# Altium schematic sheet 02-Power.SchDoc: ECE315 Analog
size A; Date: 4/25/2017; ApprovedBy: JSK; CheckedBy: JSK; Author: JSK; CompanyName: University of Wisconsin; DrawnBy: JSK; Engineer: JSK; Organization: ECE 315; Address1: College of Engineering; Address2: 1415 Engineering Drive; Address3: Madison, WI 53706; Address4: ECE 315 Fall 2017; Revision: A; SheetNumber: 2; SheetTotal: 2; AssemblyNumber: ECE315-F19; ApprovedDate: 04/02/2019
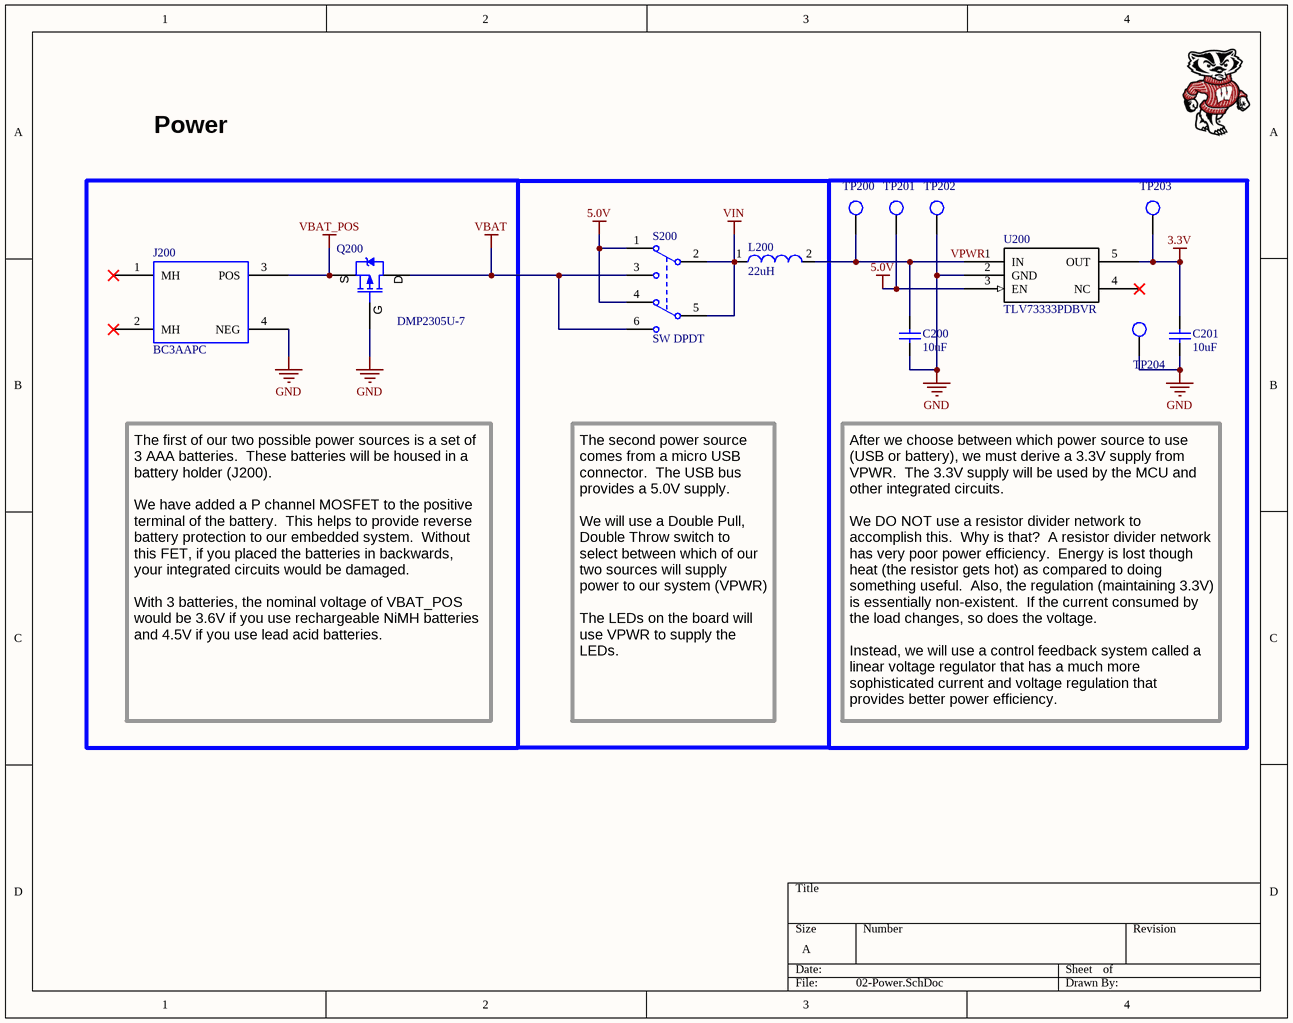
[diagram p0: 02-Power.SchDoc]

## Parts
C200  10uF  [CAP_0805]
C201  10uF  [CAP_0805]
J200  BC3AAPC  [BC3AAPC]
L200  Inductance: 22uH  [SRN3015]  (hidden comment: SRN3015-220M)
Q200  Manufacturer Part Number: DMP2305U-7  [SOT23]  (hidden comment: PMOS-DMP2305U-7)
S200  SW DPDT  [DPDT]
TP200  TP_1206  [TP-SMC-1206]  (value not drawn)
TP201  TP_1206  [TP-SMC-1206]  (value not drawn)
TP202  TP_1206  [TP-SMC-1206]  (value not drawn)
TP203  TP_1206  [TP-SMC-1206]  (value not drawn)
TP204  TP_1206  [TP-SMC-1206]  (value not drawn)
U200  Manufacturer Part Number: TLV73333PDBVR  [IC_TLV73333]  (hidden comment: IC-TLV733P)

## Nets
3.3V: C201.2 TP203.1 U200.5(OUT)
5.0V: S200.1(NC1) S200.4(NC2) TP201.1 U200.3(EN)
GND: C200.1 C201.1 J200.4(NEG) Q200.1(G) TP202.1 TP204.1 U200.2(GND)
VBAT: Q200.3(D) S200.3(NO1) S200.6(NO2)
VBAT_POS: J200.3(POS) Q200.2(S)
VIN: L200.1 S200.2(COMMON1) S200.5(COMMON2)
VPWR: C200.2 L200.2 TP200.1 U200.1(IN)

Not connected (* = marked no-connect by the designer): J200 1(MH)* 2(MH)*; U200 4(NC)*

## Notes on the sheet
- Power
- The first of our two possible power sources is a set of 3 AAA batteries.  These batteries will be housed in a battery holder (J200).
  We have added a P channel MOSFET to the positive terminal of the battery.  This helps to provide reverse battery protection to our embedded system.  Without this FET, if you placed the batteries in backwards, your integrated circuits would be damaged.
  With 3 batteries, the nominal voltage of VBAT_POS would be 3.6V if you use rechargeable NiMH batteries and 4.5V if you use lead acid batteries.
- The second power source comes from a micro USB connector.  The USB bus provides a 5.0V supply.
  We will use a Double Pull, Double Throw switch to select between which of our two sources will supply power to our system (VPWR)
  The LEDs on the board will use VPWR to supply the LEDs.
- After we choose between which power source to use (USB or battery), we must derive a 3.3V supply from VPWR.  The 3.3V supply will be used by the MCU and other integrated circuits.
  We DO NOT use a resistor divider network to accomplish this.  Why is that?  A resistor divider network has very poor power efficiency.  Energy is lost though heat (the resistor gets hot) as compared to doing something useful.  Also, the regulation (maintaining 3.3V) is essentially non-existent.  If the current consumed by the load changes, so does the voltage.
  Instead, we will use a control feedback system called a linear voltage regulator that has a much more sophisticated current and voltage regulation that provides better power efficiency.

## Library data of the parts
C200 C201 = CAP_0805_U_010.00: CAP CER 10UF 16V X7R 0805; Manufacturer: Samsung; Manufacturer Part Number: CL21A106KPCLQNC; Tolerance: 10%; Voltage Rating: 10V; Dielectric: X5R; ComponentLink3URL: https://datasheet.ciiva.com/26920/getdatasheetpartid-355170-26920201.pdf; ComponentLink3Description: https://datasheet.ciiva.com/26920/getdatasheetpartid-355170-26920201.pdf; Supplier 1: Digi-Key; Stock 1: 40000; Pricing 1: 1=0.22, 10=0.148, 100=0.0749, 500=0.05122, 1000=0.04531 (USD); Mount: Surface Mount; Case/Package: 0805; Case Code (Metric): 2012; Case Code (Imperial): 0805; Contact Plating: Tin; Min Operating Temperature: -55°C; Max Operating Temperature: 85°C; Packaging: Tape and Reel; Package Quantity: 1; Length: 2mm; Height: 0.85mm; Width: 0.049inch; Thickness: 0.037inch; Depth: 1.25mm; Radiation Hardening: No; ComponentLink1URL: https://datasheet.ciiva.com/25730/cl21a106kpclqnc-25730594.pdf; ComponentLink1Description: https://datasheet.ciiva.com/25730/cl21a106kpclqnc-25730594.pdf; Supplier Part Number 1: 1276-2402-1-ND; Capacitance: 10uF
J200 = BC3AAPC: BATTERY HOLDER AA 3 CELL PC PIN; Manufacturer: Memory Protection Devices; Number of Cells: 3; Package Quantity: 100; Termination: PC Pin; Min Operating Temperature: -10°C; Supplier: Digi-Key; Max Operating Temperature: 100°C; Mount: Through Hole,PCB; ComponentLink1URL: http://www.memoryprotectiondevices.com/datasheets/BC3AAPC-datasheet.pdf?src-supplier=Digi-Key; ComponentLink1Description: http://www.memoryprotectiondevices.com/datasheets/BC3AAPC-datasheet.pdf?src-supplier=Digi-Key; Supplier Part Number: BC3AAPC-ND; Manufacturer Part Number: BC3AAPC
L200 = SRN3015-220M: 22uH 3x3mm sheilded inductor 600mA; Manufacturer 1: Bourns; Core Material: Ferrite; Saturation Current: 580mA; Tolerance: 20%; Shielding: Shielded; Self Resonant Frequency: 28MHz; DC Resistance (DCR): 622mR; Test Frequency: 1MHz; Supplier 1: Digi-Key; Stock 1: 46536; Pricing 1: 1=0.46000, 10=0.40300, 100=0.28750, 500=0.24150, 1000=0.19550 (USD); RoHS: Yes; Case/Package: 1212; Number of Pins: 2; Weight: 0.001235oz; Contact Plating: Tin; Min Operating Temperature: -40°C; Max Operating Temperature: 125°C; Package Quantity: 2000; Inductance Tolerance: 20%; Packaging: Tape and Reel; Current Rating: 600mA; Composition: Wirewound; Max DC Current: 600mA; Termination: SMD/SMT; DC Current: 600mA; Military Standard: Not; RMS Current (Irms): 600mA; Length: 3.1mm; Height: 1.5mm; Width: 0.118inch; Height - Seated (Max): 0.059inch; Depth: 3.1mm; REACH SVHC: No SVHC; ComponentLink1URL: https://datasheet.ciiva.com/11802/0900766b80fe1f40-11802602.pdf?src-supplier=RSComponents; ComponentLink1Description: https://datasheet.ciiva.com/11802/0900766b80fe1f40-11802602.pdf?src-supplier=RSComponents; ComponentLink2URL: https://datasheet.ciiva.com/1048/srn3015-1048848.pdf?src-supplier=Digi-Key; ComponentLink2Description: https://datasheet.ciiva.com/1048/srn3015-1048848.pdf?src-supplier=Digi-Key; ComponentLink3URL: https://datasheet.ciiva.com/1048/srn3015-1048849.pdf?src-supplier=Digi-Key; ComponentLink3Description: https://datasheet.ciiva.com/1048/srn3015-1048849.pdf?src-supplier=Digi-Key; ComponentLink4URL: https://datasheet.ciiva.com/1048/srn3015-1048850.pdf?src-supplier=Digi-Key; ComponentLink4Description: https://datasheet.ciiva.com/1048/srn3015-1048850.pdf?src-supplier=Digi-Key; ComponentLink5URL: https://datasheet.ciiva.com/30089/587srn3015-30089590.pdf?src-supplier=Onlinecomponents.com; ComponentLink5Description: https://datasheet.ciiva.com/30089/587srn3015-30089590.pdf?src-supplier=Onlinecomponents.com; ComponentLink6URL: https://datasheet.ciiva.com/7849/1481208-7849511.pdf?src-supplier=Element14; ComponentLink6Description: https://datasheet.ciiva.com/7849/1481208-7849511.pdf?src-supplier=Element14; ComponentLink7URL: https://datasheet.ciiva.com/22678/1875284-22678991.pdf?src-supplier=Element14; ComponentLink7Description: https://datasheet.ciiva.com/22678/1875284-22678991.pdf?src-supplier=Element14; Manufacturer Part Number 1: SRN3015-220M; Supplier Part Number 1: SRN3015-220MCT-ND
Q200 = PMOS-DMP2305U-7: MOSFET P-CH 20V 4.2A SOT-23; Manufacturer: Diodes Zetex; Turn-Off Delay Time: 53.8ns; Drain to Source Breakdown Voltage: -20V; Number of Channels: 1; On-State Resistance: 60mR; Power Dissipation: 1.4W; Input Capacitance: 727pF; Turn-On Delay Time: 14ns; Rise Time: 13ns; Gate to Source Voltage (Vgs): 8V; Element Configuration: Single; Threshold Voltage: -500mV; ComponentLink1Description: Manufacturer Link; ComponentLink1URL: http://www.irf.com/; ComponentLink2URL: http://www.diodes.com/_files/datasheets/ds30149.pdf?src-supplier=Future+Electronics; ComponentLink2Description: http://www.diodes.com/_files/datasheets/ds30149.pdf?src-supplier=Future+Electronics; ComponentLink3URL: http://www.diodes.com/datasheets/ds31737.pdf?src-supplier=Avnet+Asia; ComponentLink3Description: http://www.diodes.com/datasheets/ds31737.pdf?src-supplier=Avnet+Asia; Contact Plating: Tin,Matte; Weight: 0.000282oz; Continuous Drain Current (ID): 4.2A; Min Operating Temperature: -55°C; Number of Elements: 1; Mount: Surface Mount; Number of Pins: 3; REACH SVHC: No SVHC; Radiation Hardening: No; Length: 2.9mm; Drain to Source Voltage (Vdss): 20V; Case/Package: SOT-23; Rds On Max: 60mR; Lead Free: Lead Free; Packaging: Tape and Reel; Fall Time: 13ns; Max Power Dissipation: 1.4W; Drain to Source Resistance: 60mR; Max Operating Temperature: 150°C; Width: 1.3mm; Package Quantity: 3000; Supplier: Digi-Key; Height: 1mm; Supplier Part Number: DMP2305UDICT-ND
S200 = SW DPDT: Switch; Manufacturer: ITT /  C&K Components; Manufacturer Part Number: JS202011SCQN; Actuator Color: Black; Maximum DC Voltage Rating: 6 V; Actuator Material: Nylon 4/6; Electrical Life: 15000 Cycles; Body Orientation: Straight; Maximum Contact Resistance: 70 mOhm; Actuator Style: Top Slide; Dielectric Strength: 500 VAC; Minimum Insulation Resistance: 100 MOhm; Contact Rating @ Voltage: 0.3@6VDC A; COO: US; Published: 24-Mar-1999; LatestRevisionDate: 29-May-2009; LatestRevisionNote: IPC-7351 Footprint Added.; PackageVersion: Mar-2001; PackageReference: SOT23-6; Publisher: Altium Limited; PackageDescription: 6-Pin SOT-23 Package 0.95 mm Pitch, 2.7 mm Lead Span; Code_JEITA: SC-74; Code_IPC: SOT26A-6; Supplier 1: C&K Components; Stock 1: 22661; Pricing 1: 1=0.46, 10=0.441, 25=0.4316, 50=0.3858, 100=0.3674, 250=0.3582, 500=0.3031 (USD); Part No: JS202011SCQN; RoHS: Yes; Supplier Standard Pack: 5,000; Type: Sub-Miniature; Maximum AC Voltage Rating: N/A; Family: JS; Contact Material: Copper Alloy; Seal Description: N/A; Pole Throw Configuration: DPDT; Mechanical Life: N/A; Packaging: Tape and Reel; Contact Plating: Silver; Switch Configuration: N/A; Housing Material: Nylon 4/6; Product Weight: N/A; Base Material: N/A; Mounting: Surface Mount,Gull Wing; Seal Location: N/A; Operating Temperature: -40 to 85 C; Dimension: 9 x 7.5 x 5.5 mm; HTS: 8536509050; ECCN: EAR99; ComponentLink1URL: https://datasheet.ciiva.com/23829/1707718-23829488.pdf; ComponentLink1Description: https://datasheet.ciiva.com/23829/1707718-23829488.pdf; ComponentLink2URL: https://datasheet.ciiva.com/2889/js-29aug13-2889127.pdf; ComponentLink2Description: https://datasheet.ciiva.com/2889/js-29aug13-2889127.pdf; ComponentLink3URL: https://datasheet.ciiva.com/2889/js-15sept15-2889128.pdf; ComponentLink3Description: https://datasheet.ciiva.com/2889/js-15sept15-2889128.pdf; ComponentLink4URL: https://datasheet.ciiva.com/2889/js-15sept15-2889129.pdf; ComponentLink4Description: https://datasheet.ciiva.com/2889/js-15sept15-2889129.pdf; ComponentLink5URL: https://datasheet.ciiva.com/22630/1707718-22630697.pdf; ComponentLink5Description: https://datasheet.ciiva.com/22630/1707718-22630697.pdf; ComponentLink6URL: https://datasheet.ciiva.com/8625/js-9dec14-8625470.pdf; ComponentLink6Description: https://datasheet.ciiva.com/8625/js-9dec14-8625470.pdf; Supplier Part Number 1: 401-2002-1-ND
TP200-TP204 = TP_1206: Test Point SMD 1206; Manufacturer: TE Connectivity (Tyco Electronics); Manufacturer Part Number: 1625854-1; Resistance Value: 0 Ohm; Temperature Coefficient: N/R; Supplier 1: Digi-Key; Stock 1: 31937; Pricing 1: 1=0.28, 10=0.261, 25=0.224, 50=0.1902, 100=0.1828, 250=0.1641, 500=0.1567, 1000=0.1306 (USD); Case Size: 1206; Dimension: 3.2 x 1.6 x 1.25mm; Family: RC; Mounting: Surface Mount; Operating Temperature: -55 to 125 C; Part No: 1625854-1; RoHS: Yes; Packaging: Tape and Reel; Termination Style: N/R; Terminal Pitch: N/R; Power Rating: N/R; Tolerance: N/R; ComponentLink1URL: https://datasheet.ciiva.com/6439/eng-ds-1773266-a-6439169.pdf; ComponentLink1Description: https://datasheet.ciiva.com/6439/eng-ds-1773266-a-6439169.pdf; ComponentLink2URL: https://datasheet.ciiva.com/30136/1773266-a-30136341.pdf; ComponentLink2Description: https://datasheet.ciiva.com/30136/1773266-a-30136341.pdf; ComponentLink3URL: https://datasheet.ciiva.com/6439/eng-ds-1773266-a-6439080.pdf; ComponentLink3Description: https://datasheet.ciiva.com/6439/eng-ds-1773266-a-6439080.pdf; ComponentLink4URL: https://datasheet.ciiva.com/6439/eng-ds-1773266-a-6439081.pdf; ComponentLink4Description: https://datasheet.ciiva.com/6439/eng-ds-1773266-a-6439081.pdf; ComponentLink5URL: https://datasheet.ciiva.com/6439/eng-ds-1773266-a-6439083.pdf; ComponentLink5Description: https://datasheet.ciiva.com/6439/eng-ds-1773266-a-6439083.pdf; Supplier Part Number 1: A106143CT-ND
U200 = IC-TLV733P: IC REG LINEAR 3.3V 300MA SOT23-5; Manufacturer: Texas Instruments; Number of Outputs: 1; Min Input Voltage: 1.4V; Max Input Voltage: 5.5V; Dropout Voltage: 125mV; Min Current Limit: 360mA; Polarity: Positive; Quiescent Current: 60uA; Accuracy: 1%; Supplier 1: Digi-Key; Stock 1: 44968; Pricing 1: 1=0.46, 10=0.373, 100=0.2538, 500=0.19034, 1000=0.14276 (USD); Mount: Surface Mount; Case/Package: SOT-23-5; Number of Pins: 5; Weight: 0.000557oz; Contact Plating: Nickel,Gold; Min Operating Temperature: -40°C; Max Operating Temperature: 125°C; Packaging: Tape and Reel; Max Output Current: 300mA; Output Voltage: 3.3V; Output Current: 300mA; Number of Regulators: 1; Package Quantity: 3000; Radiation Hardening: No; Lead Free: Lead Free; ComponentLink1URL: https://datasheet.ciiva.com/48677/tlv733p-48677542.pdf; ComponentLink1Description: https://datasheet.ciiva.com/48677/tlv733p-48677542.pdf; Supplier Part Number 1: 296-40673-1-ND